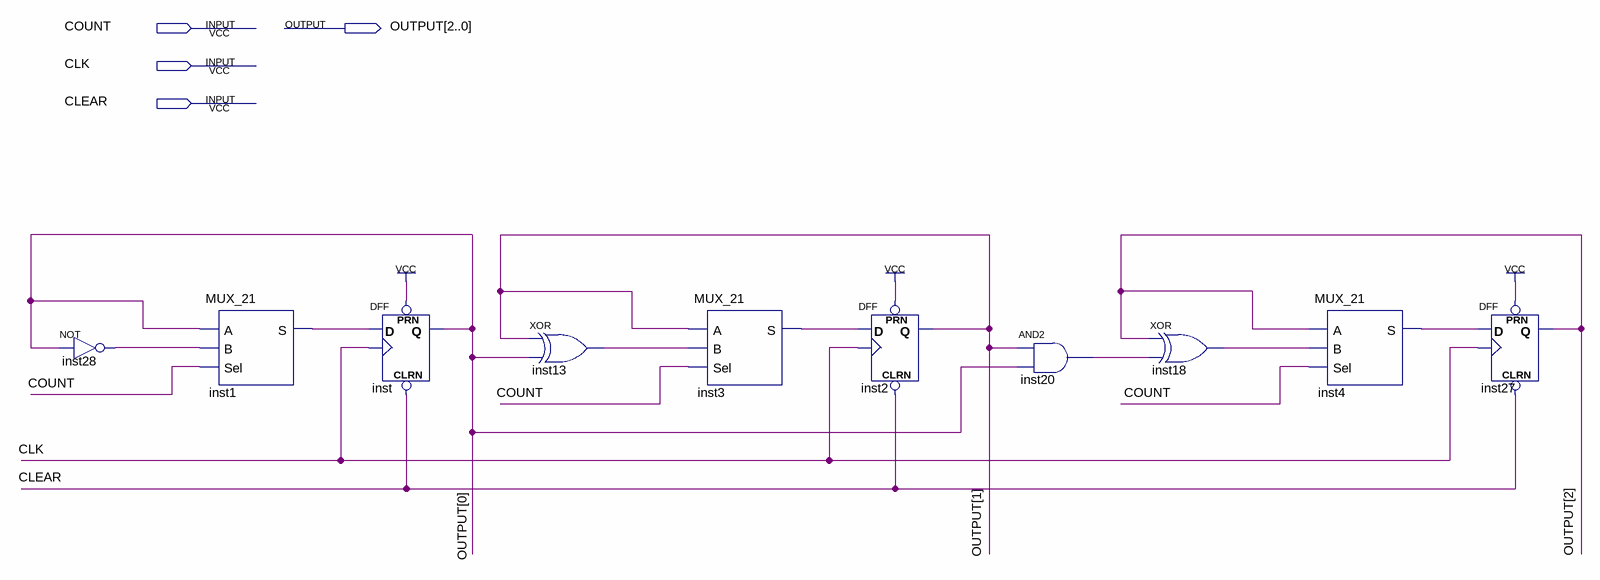
[diagram p0: schematic sheet]
// Quartus schematic EIGHT_SEC_TIMER.bdf as structural Verilog: 10 symbols, 4 pins
module EIGHT_SEC_TIMER (
  input  COUNT,
  input  CLK,
  input  CLEAR,
  output [2:0] OUTPUT
);

  wire inst1_s, inst3_s, inst4_s, inst13_out, inst18_out, inst20_out, inst28_out;

  not inst28 (inst28_out, OUTPUT[0]);
  MUX_21 inst1 (.A(OUTPUT[0]), .B(inst28_out), .Sel(COUNT), .S(inst1_s));
  DFF inst (.CLRN(CLEAR), .CLK(CLK), .D(inst1_s), .PRN(1'b1), .Q(OUTPUT[0]));
  xor inst13 (inst13_out, OUTPUT[1], OUTPUT[0]);
  MUX_21 inst3 (.A(OUTPUT[1]), .B(inst13_out), .Sel(COUNT), .S(inst3_s));
  DFF inst2 (.CLRN(CLEAR), .CLK(CLK), .D(inst3_s), .PRN(1'b1), .Q(OUTPUT[1]));
  and inst20 (inst20_out, OUTPUT[1], OUTPUT[0]);
  xor inst18 (inst18_out, OUTPUT[2], inst20_out);
  MUX_21 inst4 (.A(OUTPUT[2]), .B(inst18_out), .Sel(COUNT), .S(inst4_s));
  DFF inst27 (.CLRN(CLEAR), .CLK(CLK), .D(inst4_s), .PRN(1'b1), .Q(OUTPUT[2]));
endmodule
